# Altium schematic sheet 04_IMU.SchDoc
size A
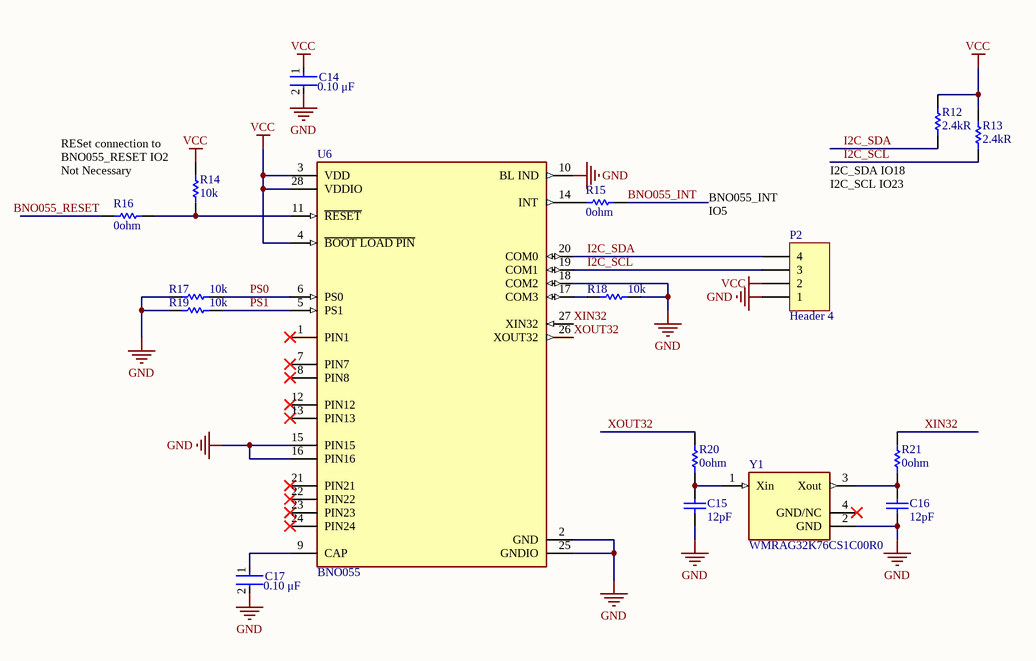
[diagram p0: 04_IMU.SchDoc]

## Parts
C14  Capacitance: 0.10 μF  [FP-C0603C-CF-MFG]  (hidden comment: C0603C104M4RAC7411)
C15  value 12pF  [CAPC1608X90X40NL10T20]  (hidden comment: CC0603JRNPO9BN120)
C16  value 12pF  [CAPC1608X90X40NL10T20]  (hidden comment: CC0603JRNPO9BN120)
C17  Capacitance: 0.10 μF  [FP-C0603C-CF-MFG]  (hidden comment: C0603C104M4RAC7411)
P2  Header 4  [HDR1X4]
R12  value 2.4kR  [RESC1608X50X30ML20T20]  (hidden comment: RR0816P-242-D)
R13  value 2.4kR  [RESC1608X50X30ML20T20]  (hidden comment: RR0816P-242-D)
R14  value 10k  [RESC1609X55X30LL15T15]  (hidden comment: ERJ3EKF1002V)
R15  value 0ohm  [RESC1608X55X25ML10T15]  (hidden comment: RC0603JR-070RL)
R16  value 0ohm  [RESC1608X55X25ML10T15]  (hidden comment: RC0603JR-070RL)
R17  value 10k  [RESC1609X55X30LL15T15]  (hidden comment: ERJ3EKF1002V)
R18  value 10k  [RESC1609X55X30LL15T15]  (hidden comment: ERJ3EKF1002V)
R19  value 10k  [RESC1609X55X30LL15T15]  (hidden comment: ERJ3EKF1002V)
R20  value 0ohm  [RESC1608X55X25ML10T15]  (hidden comment: RC0603JR-070RL)
R21  value 0ohm  [RESC1608X55X25ML10T15]  (hidden comment: RC0603JR-070RL)
U6  BNO055  [FP-BNO055-MFG]
Y1  WMRAG32K76CS1C00R0  [FP-WMRAG32K76CS1C00R0-MFG]

## Nets
GND: C14.2 C15.1 C16.1 C17.2 P2.1 R17.1 R18.1 R19.1 U6.2(GND) U6.10(BL_IND) U6.15(PIN15) U6.16(PIN16) U6.18(COM2) U6.25(GNDIO) Y1.2(GND)
VCC: C14.1 P2.2 R12.2 R13.2 R14.2 U6.3(VDD) U6.4(~{BOOT_LOAD_PIN}) U6.28(VDDIO)
BNO055_INT: R15.2
BNO055_RESET: R16.1
I2C_SCL: P2.3 R13.1 U6.19(COM1)
I2C_SDA: P2.4 R12.1 U6.20(COM0)
PS0: R17.2 U6.6(PS0)
PS1: R19.2 U6.5(PS1)
XIN32: R21.1 U6.27(XIN32)
XOUT32: R20.1 U6.26(XOUT32)
NetC15_2: C15.2 R20.2 Y1.1(Xin)
NetC16_2: C16.2 R21.2 Y1.3(Xout)
NetC17_1: C17.1 U6.9(CAP)
NetR14_1: R14.1 R16.2 U6.11(~{RESET})
NetR15_1: R15.1 U6.14(INT)
NetR18_2: R18.2 U6.17(COM3)

Not connected (* = marked no-connect by the designer): U6 1(PIN1)* 7(PIN7)* 8(PIN8)* 12(PIN12)* 13(PIN13)* 21(PIN21)* 22(PIN22)* 23(PIN23)* 24(PIN24)*; Y1 4(GND/NC)*

## Notes on the sheet
- RESet connection to
  BNO055_RESET IO2
  Not Necessary
- I2C_SDA IO18
  I2C_SCL IO23
- (near P2) BNO055_INT
  IO5

## Library data of the parts
C14 C17 = CMP-03020-016578-1: CAP CER 0.1UF 16V X7R 0603; Manufacturer: KEMET; Tolerance: 0.2; Value: 0.10 μF; Automotive Grade: Grade 1; Material: Ceramic; Temperature Coefficient: 30ppm/°C; RoHS: TRUE; Temperature: -55°C to +125°C; Automotive: Yes; Device Class L3: Ceramic Capacitors; Temperature Characteristic: X7R; Package: C0603C-CF; Digikey Description: CAP CER 0.1UF 16V X7R 0603; Manufacturer Part Number: C0603C104M4RAC7411; ComponentLink2URL: https://api.kemet.com/component-edge/download/datasheet/C0603C100J5GACAUTO.pdf; Mouser Description: Multilayer Ceramic Capacitors MLCC - SMD/SMT 16volts 0.1uF X7R 20%; Voltage Rating: 16 V; Temperature Range High: +125°C; Temperature Range Low: -55°C; Height: 0.87mm; Device Class L1: Passive Components; ComponentLink2Description: Datasheet; Lead Free: Yes; Category: Cap; Device Class L2: Capacitors; Octopart: https://octopart.com/c0603c104m4rac7411-kemet-9138805
C15 C16 = CMP-1659-00031-1: Chip Capacitor, 12 pF, +/- 5%, 50 V, -55 to 125 degC, 0603 (1608 Metric), RoHS, Tape and Reel; Tolerance: 1%; Voltage Rating: 250 V; Case\Package: Axial; Power Rating: 250 mW; Resistance: 475 kohm; Mount: Through Hole; Length: 0.248 inch; PackageReference: 0603; DatasheetVersion: Rev. 14, 07/2016; Packaging: Bulk; Max Operating Temperature: 155 degC; Min Operating Temperature: -55 degC; ComponentLink2Description: Datasheet; ComponentLink2URL: http://www.yageo.com/NewPortal/yageodocoutput?fileName=/pdf/MLCC/UPY-GP_NP0_16V-to-50V_14.pdf; ComponentLink1URL: http://www.yageo.com/; PackageDescription: 2-Pin Surface Mount Device, Body 1.6 x 0.8 mm; Package Quantity: 200; RoHSCompliant: true; ComponentLink1Description: Manufacturer URL
P2 = Header 4: Header, 4-Pin; LatestRevisionDate: 17-Jul-2002; LatestRevisionNote: Re-released for DXP Platform.; Publisher: Altium Limited
R12 R13 = CMP-2000-02561-1: Manufacturer: Susumu; Part Number: RR0816P-242-D
R14 R17-R19 = CMP-2000-07452-1: Chip Resistor, 10 KOhm, +/- 1%, 0.1 W, -55 to 155 degC, 0603 (1608 Metric), RoHS, Tape and Reel; Manufacturer: Panasonic; Voltage Rating: 75V; Case\/Package: 0603; Power Rating: 100mW; Resistance: 10KOhm; Temperature Coefficient: 100ppm\/degreesC; Number of Pins: 2; Package Reference: 603; Depth: 0.8mm; Mount: SurfaceMount; Package Description: 2-Pin Surface Mount Device, Body 1.6 x 0.85 mm; Datasheet Version: 02/2017; Length: 1.6mm; Lead Free: LeadFree; Height: 0.45mm; Number of Terminations: 2; Max Power Dissipation: 100mW; Min Operating Temperature: -55degC; Datasheet URL: https://industrial.panasonic.com/cdbs/www-data/pdf/RDA0000/AOA0000C304.pdf; Termination: SMD/SMT; Case Code (Metric): 1608; Case Code (Imperial): 0603; Tolerance: 1%; Max Operating Temperature: 155degC; RoHSCompliant: true; Voltage Rating (DC): 75V; Radiation Hardening: No; Packaging: TapeandReel; Composition: ThickFilm; Mounting Technology: SurfaceMount; Manufacturer URL: http://www.panasonic.com/; Width: 0.031inch; REACH SVHC: NoSVHC; Contact Plating: Tin; Military Standard: Not; Package Quantity: 1
R15 R16 R20 R21 = CMP-2100-03667-1: Chip Resistor, 0 Ohm, +/- 5%, 0.1 W, -55 to 155 degC, 0603 (1608 Metric), RoHS, Tape and Reel; Manufacturer: Yageo; Temperature Coefficient: 200ppm/degreesC; Voltage Rating: 50V; Power Rating: 100mW; Resistance: 0mOhm; Width: 0.8mm; Max Operating Temperature: 155degC; Tolerance: 5%; Package Reference: 0603; Height: 0.45mm; Depth: 0.8mm; Package Description: 2-Pin Surface Mount Device, Body 1.6 x 0.8 mm; Termination: SMD/SMT; Package Quantity: 5000; Case/Package: 0603; Case Code (Imperial): 0603; Radiation Hardening: No; Number of Pins: 2; Length: 1.6mm; Lead Free: LeadFree; Voltage Rating (DC): 50V; Military Standard: Not; Datasheet URL: http://www.yageo.com/NewPortal/yageodocoutput?fileName=/pdf/R-Chip/PYu-RC_Group_51_RoHS_L_5.pdf; Manufacturer URL: http://www.yageo.com/; Packaging: TapeandReel; Case Code (Metric): 1608; Min Operating Temperature: -55degC; Composition: ThickFilm; RoHSCompliant: true; Contact Plating: Tin; Datasheet Version: Rev. 5, 10/2016; REACH SVHC: NoSVHC
U6 = CMP-191067-000002-1: IMU ACCEL/GYRO/MAG I2C 28LGA; Manufacturer: Bosch Sensortech; Max Supply Voltage: 3.6V; Voltage: 1.7~3.6V; Operating Supply Current: 12.3mA; Gyro Sensitivity: 16LSB/°/s; Sensor Type: Accelerometer,Gyroscope,Magnetometer; Accel Sensitivity: 0.001LSB/g; Min Supply Voltage: 1.7V; Accel Range: 2/4/8/16g; Accel Resolution: 14bits; Sensor Output: I2C,UART; Gyro Range: 125/250/500/1000/2000°/s; Mag Sense Range: 1300-2500uT; Octopart: https://octopart.com/bno055-bosch+sensortec-50309911; Height: 1.18mm; Automotive: No; Mouser Description: BNO055 Series 1.7 to 3.6 V Intelligent 9-Axis Absolute Orientation Sensor-LGA-28; Lead Free: Yes; Temperature Range High: +85°C; Ambient Temperature Range Low: -40°C; Ambient Temperature Range High: +85°C; Device Class L1: Sensors; Device Class L3: Inertial Measurement Units (IMUs); ComponentLink2URL: https://ae-bst.resource.bosch.com/media/_tech/media/datasheets/BST-BNO055-DS000.pdf; Temperature Range Low: -40°C; Manufacturer Part Number: BNO055; Digikey Description: IMU ACCEL/GYRO/MAG I2C 28LGA; Device Class L2: Motion Sensors; RoHS: TRUE; Category: IC; Temperature: -40°C to +85°C; ComponentLink2Description: Datasheet; Package: 0
Y1 = CMP-06054-000002-1: MEMS Resonator; Manufacturer: Murata; Tolerance: 20ppm; Frequency: 32.768kHz; Esr: 75kΩ; Load Capacitance: 8pF; Temperature Range High: +85°C; Manufacturer Part Number: WMRAG32K76CS1C00R0; Device Class L2: Crystals / Oscillators; Category: Crys; ComponentLink2URL: https://www.murata.com/en-us/products/productdetail?partno=WMRAG32K76CS1C00R0; Package: WMRAG32K76CS1C00R0; Temperature: -30°C to +85°C; Automotive: No; Device Class L1: Passive Components; Octopart: https://octopart.com/wmrag32k76cs1c00r0-murata-103936783; ComponentLink2Description: Datasheet; RoHS: TRUE; Lead Free: Yes; Device Class L3: Crystals; Footprint Url: https://forum.upverter.com/uploads/default/original/3X/c/9/c928dfaf44ae48bfe51164a60c1d28063cd1860b.pdf; Temperature Range Low: -30°C